# Altium schematic sheet output_filter.SchDoc
size A4; Author: Mikołaj Pichita; CompanyName: AGH University of Science and Technology; SheetNumber: 8; SheetTotal: 16
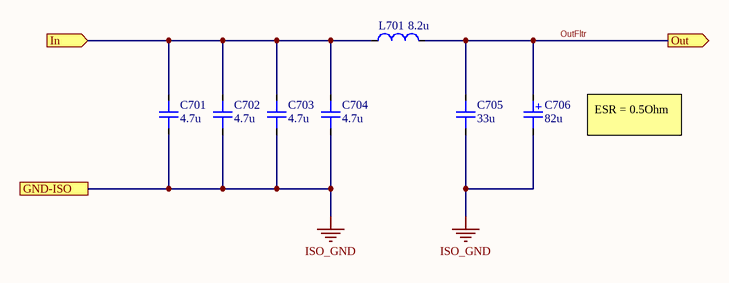
[diagram p0: output_filter.SchDoc]

## Parts
C701  4.7u  [CAP1206]
C702  4.7u  [CAP1206]
C703  4.7u  [CAP1206]
C704  4.7u  [CAP1206]
C705  33u  [CAP2220]
C706  82u  [WCAP-PSLC_D8H11.7]
L701  8.2u  [FP-IHLP-3232DZ-FP_2_413x5-MFG]

## Ports
GND-ISO (see main[3A], full_bridge[1B], input_filter[2C], isolator[4B], measurements[1B], OV_OC[1B], power_supply[3B], testpoint[1A], voltage_sense[1A]), In (in, see main[3A]), Out (out, see main[3A])

## Nets
ISO_GND: C701.2 C702.2 C703.2 C704.2 C705.2 C706.2 ; port GND-ISO
In: C701.1 C702.1 C703.1 C704.1 L701.1 ; port In
OutFltr: C705.1 C706.1 L701.2 ; port Out

## Notes on the sheet
- ESR = 0.5Ohm
- Nazwa projektu
- Nazwa dokumentu
- Nazwa firmy:
- Autor:
- Osoba sprawdzająca:
- Data:

## Library data of the parts
C701-C706 = Capacitor: Value: *; HelpURL: *; MPN: *; Supplier: *; SupplierPartNumber: *; Supplier 1: Mouser
  C701-C704: Supplier Part Number 1: 581-12065C475KAT4A
  C705: Supplier Part Number 1: 81-KRM55WR71H336MH1K
  C706: Supplier Part Number 1: 710-875115652006
L701 = Inductor: Value: *; HelpURL: *; MPN: *; Supplier: *; SupplierPartNumber: *; Supplier 1: Mouser; Supplier Part Number 1: 70-IHLP3232DZER8R2M1